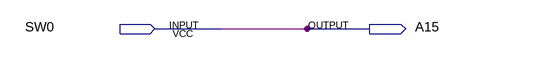
[diagram p0: schematic sheet]
// Quartus schematic introTest.bdf as structural Verilog: 0 symbols, 2 pins
module introTest (
  input  SW0,
  output A15
);


  assign A15 = SW0;
endmodule
